# EAGLE design Kobold (EAGLE 5.11)
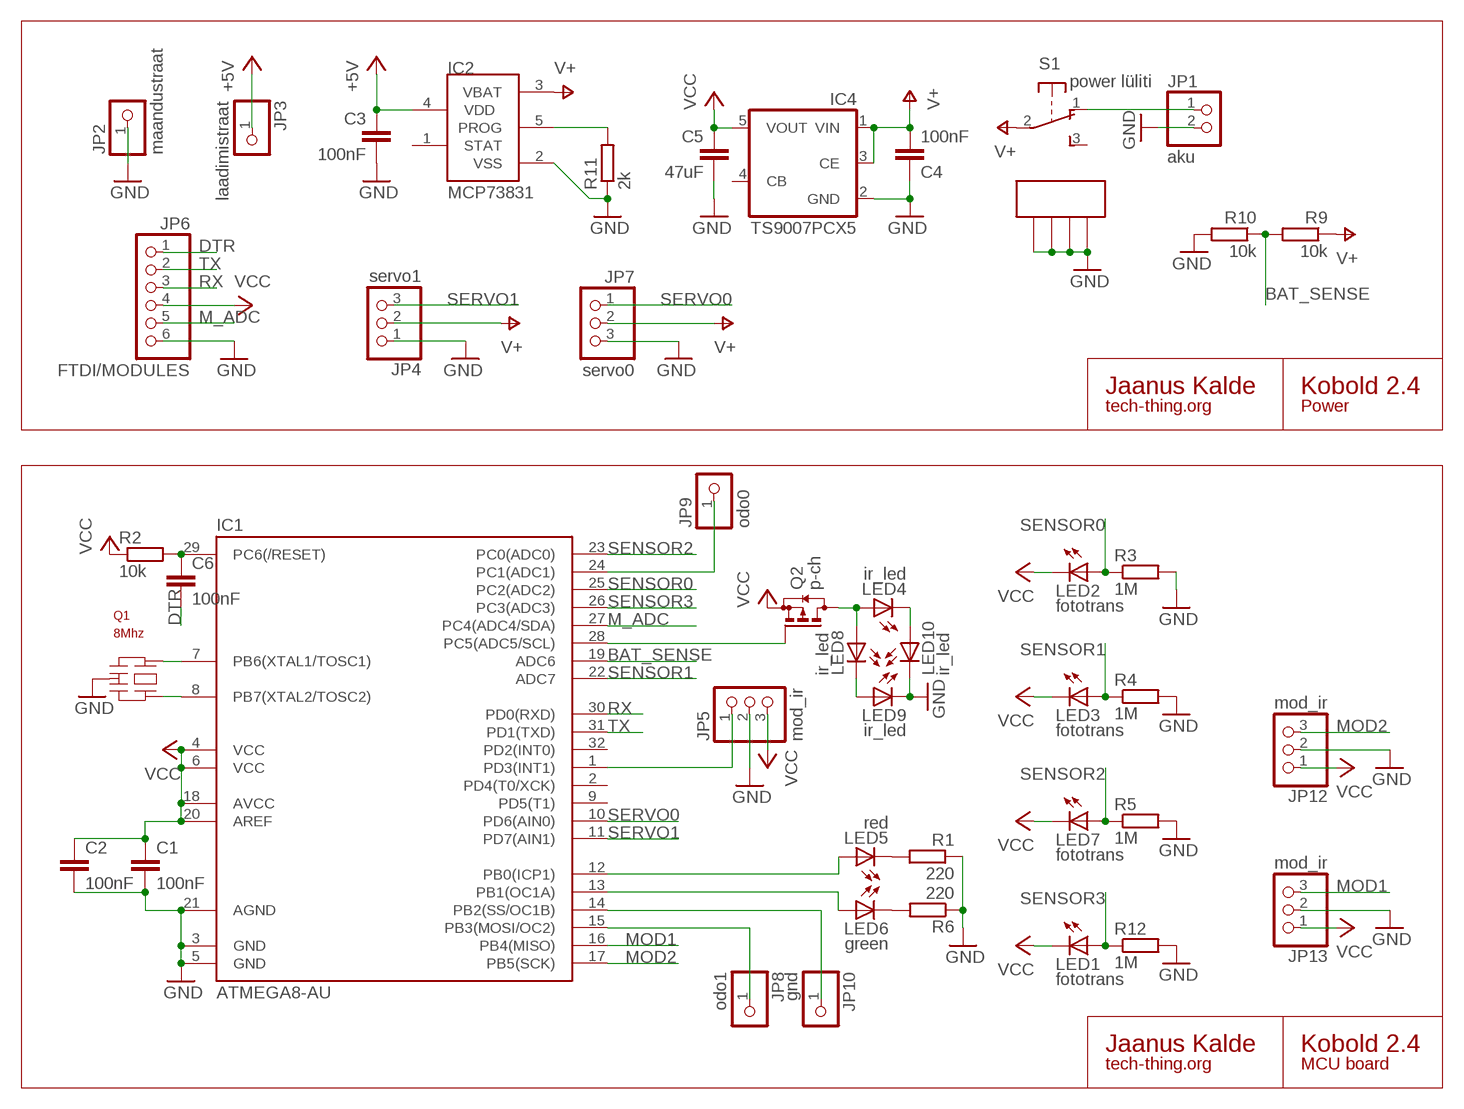
[diagram p0: schematic, sheet 1]

## Parts
C1  100nF  C-EUC0603  [C0603]
C2  100nF  C-EUC0603  [C0603]
C3  100nF  C-EUC0603  [C0603]
C4  100nF  C-EUC0603  [C0603]
C5  47uF  C-EUC3225  [C3225]
C6  100nF  C-EUC0603  [C0603]
IC1  ATMEGA8-AU  [TQFP32-08]
IC2  MCP73831  [SOT23-5L]
IC4  TS9007PCX5  TS5205  [SOT25]
JP1  aku  PINHD-1X02_2.54-S  [1X02-S]
JP2  maandustraat  PINHD-1X01_2.54-SMD-90°  [1X01SMD/90]
JP3  laadimistraat  PINHD-1X01_2.54  [1X01]
JP4  servo1  PINHD-1X03_2.54-S  [1X03-S]
JP5  mod_ir  PINHD-1X03_2.54-S  [1X03-S]
JP6  FTDI/MODULES  PINHD-1X06_2.54-S  [1X06-S]
JP7  servo0  PINHD-1X03_2.54-S  [1X03-S]
JP8  odo1  PINHD-1X01_2.54-SMD-90°  [1X01SMD/90]
JP9  odo0  PINHD-1X01_2.54-SMD-90°  [1X01SMD/90]
JP10  gnd  PINHD-1X01_2.54-SMD-90°  [1X01SMD/90]
JP12  mod_ir  PINHD-1X03_2.00  [1X03M]
JP13  mod_ir  PINHD-1X03_2.00  [1X03M]
LED1  fototrans  LED3MM  [LED3MM]
LED2  fototrans  LED3MM  [LED3MM]
LED3  fototrans  LED3MM  [LED3MM]
LED4  ir_led  LED3MM  [LED3MM]
LED5  red  LEDCHIP-LED0603  [CHIP-LED0603]
LED6  green  LEDCHIP-LED0603  [CHIP-LED0603]
LED7  fototrans  LED3MM  [LED3MM]
LED8  ir_led  LED3MM  [LED3MM]
LED9  ir_led  LED3MM  [LED3MM]
LED10  ir_led  LED3MM  [LED3MM]
Q1  8Mhz  CSTLS_G  [RES]
Q2  p-ch  BSS84  [SOT23]
R1  220  R-EU_R0603  [R0603]
R2  10k  R-EU_R0603  [R0603]
R3  1M  R-EU_R0603  [R0603]
R4  1M  R-EU_R0603  [R0603]
R5  1M  R-EU_R0603  [R0603]
R6  220  R-EU_R0603  [R0603]
R9  10k  R-EU_R0603  [R0603]
R10  10k  R-EU_R0603  [R0603]
R11  2k  R-EU_R0603  [R0603]
R12  1M  R-EU_R0603  [R0603]
S1  power lüliti  9077-1  [9077-1]

## Nets
+5V: C3.1 IC2.4(VDD) JP3.1
BAT_SENSE: IC1.19(ADC6) R9.2 R10.1
DTR: C6.2 JP6.1
GND: C1.2 C2.2 C3.2 C4.1 C5.2 IC1.3(GND) IC1.5(GND) IC1.21(AGND) IC2.2(VSS) IC4.2(GND) JP1.2 JP2.1 JP4.1 JP5.2 JP6.6 JP7.3 JP12.2 JP13.2 LED9.K(C) LED10.K(C) Q1.P$2(VSS) R1.1 R3.2 R4.2 R5.2 R6.1 R10.2 R11.1 R12.2 S1.P$1 S1.P$2 S1.P$3 S1.P$4
IR_LED: IC1.28(PC5(ADC5/SCL)) Q2.1(G)
M_ADC: IC1.27(PC4(ADC4/SDA)) JP6.5
MOD1: IC1.16(PB4(MISO)) JP13.3
MOD2: IC1.17(PB5(SCK)) JP12.3
N$1: LED6.C R6.2
N$2: IC1.13(PB1(OC1A)) LED6.A
N$3: JP1.1 S1.1(O)
N$4: IC1.15(PB3(MOSI/OC2)) JP8.1
N$5: LED8.K(C) LED9.A
N$6: LED4.K(C) LED10.A
N$7: IC1.1(PD3(INT1)) JP5.1
N$8: LED4.A LED8.A Q2.3(D)
N$9: IC1.24(PC1(ADC1)) JP9.1
N$10: IC1.7(PB6(XTAL1/TOSC1)) Q1.P$1
N$11: IC1.12(PB0(ICP1)) LED5.A
N$12: IC1.14(PB2(SS/OC1B)) JP10.1
N$15: LED5.C R1.2
N$20: IC1.8(PB7(XTAL2/TOSC2)) Q1.P$3
N$28: IC2.5(PROG) R11.2
RESET: C6.1 IC1.29(PC6(/RESET)) R2.2
RX: IC1.30(PD0(RXD)) JP6.3
SENSOR0: IC1.25(PC2(ADC2)) LED2.A R3.1
SENSOR1: IC1.22(ADC7) LED3.A R4.1
SENSOR2: IC1.23(PC0(ADC0)) LED7.A R5.1
SENSOR3: IC1.26(PC3(ADC3)) LED1.A R12.1
SERVO0: IC1.10(PD6(AIN0)) JP7.1
SERVO1: IC1.11(PD7(AIN1)) JP4.3
TX: IC1.31(PD1(TXD)) JP6.2
V+: C4.2 IC2.3(VBAT) IC4.1(VIN) IC4.3(CE) JP4.2 JP7.2 R9.1 S1.2(P)
VCC: C1.1 C2.1 C5.1 IC1.4(VCC) IC1.6(VCC) IC1.18(AVCC) IC1.20(AREF) IC4.5(VOUT) JP5.3 JP6.4 JP12.1 JP13.1 LED1.K(C) LED2.K(C) LED3.K(C) LED7.K(C) Q2.2(S) R2.1
Unconnected: IC1.2(PD4(T0/XCK)) IC1.9(PD5(T1)) IC1.32(PD2(INT0)) IC2.1(STAT) IC4.4(CB) S1.3(S)

## Notes on the sheet
- Jaanus Kalde | Kobold 2.4
- tech-thing.org | Power
- Jaanus Kalde | Kobold 2.4
- tech-thing.org | MCU board

## Library data of the parts
C1-C6 = rcl:C-EU: CAPACITOR, European symbol
IC1 = atmega8:ATMEGA8
IC2 = microchip-update:MCP73831: Miniature Single-Cell, Fully Integrated Li-Ion, Li-Polymer Charge Management Controllers
IC4 = v-reg:TS5205: 150mA Low Noise LDO Voltage Regulator with Enable TSC [Taiwan Semiconductor Company, Ltd] Source: http://www.taiwansemi.com .. 5205_0409c.pdf
JP1 = pinhead-2:PINHD-1X02: PIN HEADER
JP2 JP3 JP8-JP10 = pinhead-2:PINHD-1X01: PIN HEADER
JP4 JP5 JP7 JP12 JP13 = pinhead-2:PINHD-1X03: PIN HEADER
JP6 = pinhead-2:PINHD-1X06: PIN HEADER
LED1-LED10 = led:LED: LED OSRAM: - CHIPLED LG R971, LG N971, LY N971, LG Q971, LY Q971, LO R971, LY R971 LH N974, LH R974 LS Q976, LO Q976, LY Q976 LO Q996 - Hyper CHIPLED LW Q18S LB Q993, LB Q99A, LB R99A - SideLED LS A670, LO A670, LY A670, LG A670, LP A670 LB A673, LV A673, LT A673, LW A673 LH A674 LY A675 LS A676, LA A676, LO A676, LY A676, LW A676 LS A679, LY A679, LG A679 - Hyper Micro SIDELED® LS Y876, LA Y876, LO Y876, LY Y876 LT Y87S - SmartLED LW L88C, LW L88S LB L89C, LB L89S, LG L890 LS L89K, LO L89K, LY L89K LS L896, LA L896, LO L896, LY L896 - TOPLED LS T670, LO T670, LY T670, LG T670, LP T670 LSG T670, LSP T670, LSY T670, LOP T670, LYG T670 LG T671, LOG T671, LSG T671 LB T673, LV T673, LT T673, LW T673 LH T674 LS T676, LA T676, LO T676, LY T676, LB T676, LH T676, LSB T676, LW T676 LB T67C, LV T67C, LT T67C, LS T67K, LO T67K, LY T67K, LW E67C LS E67B, LA E67B, LO E67B, LY E67B, LB E67C, LV E67C, LT E67C LW T67C LS T679, LY T679, LG T679 LS T770, LO T770, LY T770, LG T770, LP T770 LB T773, LV T773, LT T773, LW T773 LH T774 LS E675, LA E675, LY E675, LS T675 LS T776, LA T776, LO T776, LY T776, LB T776 LHGB T686 LT T68C, LB T68C - Hyper Mini TOPLED® LB M676 - Mini TOPLED Santana® LG M470 LS M47K, LO M47K, LY M47K Source: http://www.osram.convergy.de LUXEON: - LUMILED® LXK2-PW12-R00, LXK2-PW12-S00, LXK2-PW14-U00, LXK2-PW14-V00 LXK2-PM12-R00, LXK2-PM12-S00, LXK2-PM14-U00 LXK2-PE12-Q00, LXK2-PE12-R00, LXK2-PE12-S00, LXK2-PE14-T00, LXK2-PE14-U00 LXK2-PB12-K00, LXK2-PB12-L00, LXK2-PB12-M00, LXK2-PB14-N00, LXK2-PB14-P00, LXK2-PB14-Q00 LXK2-PR12-L00, LXK2-PR12-M00, LXK2-PR14-Q00, LXK2-PR14-R00 LXK2-PD12-Q00, LXK2-PD12-R00, LXK2-PD12-S00 LXK2-PH12-R00, LXK2-PH12-S00 LXK2-PL12-P00, LXK2-PL12-Q00, LXK2-PL12-R00 Source: www.luxeon.com KINGBRIGHT: KA-3528ASYC Source: www.kingbright.com
Q1 = oma:CSTLS_G: Ceramic resonator 2.00 to 10.00 MHz
Q2 = transistor-small-signal:BSS84: P-CHANNEL MOS FET
R1-R6 R9-R12 = rcl:R-EU_: RESISTOR, European symbol
S1 = oma:9077-1: MARQUARDT SWITCH

## Board
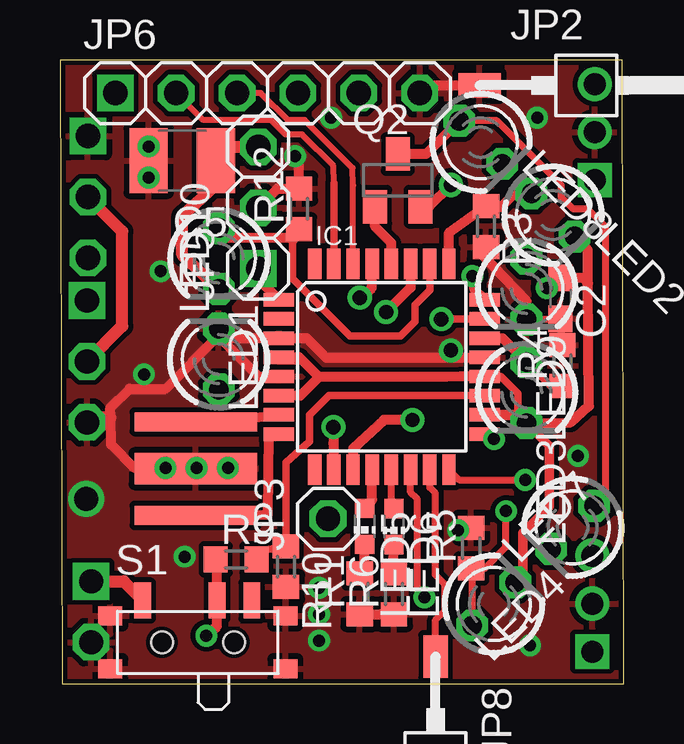
[diagram p1: board, top side]
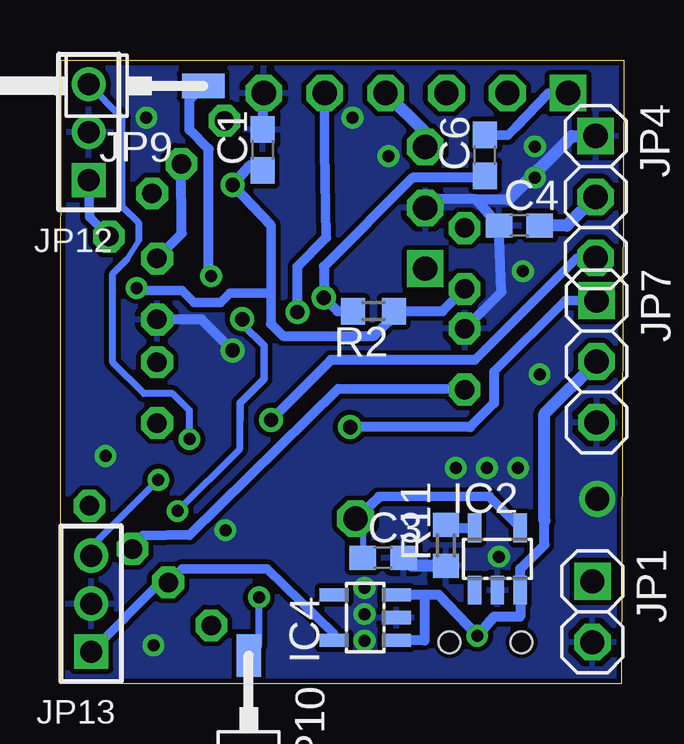
[diagram p2: board, bottom side, seen from below]

Size 23.5 x 26.01 mm. Coordinates in mm from the lower left corner, seen from the top.
Outline: 0.1,0 23.5,0 23.44,26.01 18.3,26 0,26.01 0.1,0
Copper layers (1+16): Top 0.035mm / dielectric 1.5mm / Bottom 0.035mm
Design rules "8mils *": minimum track width 8mil, minimum drill 0.4mm, track to track 8mil, track to pad 8mil, pad to pad 8mil, via to via 8mil, smd to smd 0mil, copper to edge 8mil, drill to drill 8mil, minimum pad ring 10mil, minimum via ring 8mil, stop-mask expansion 0mil, vias tented up to drill 0mil, thermal gap 10mil

### Footprints (pad centres in the part's own frame; a part is rotated, then mirrored left to right if it is on the bottom)
C0603 = smd 1.1 x 1: 1 -0.85,0; 2 0.85,0
C3225 = smd 1.6 x 2.7: 1 -1.4,0; 2 1.4,0
TQFP32-08 = smd 1.27 x 0.559: 1 -4.293,2.8; 2 -4.293,2; 3 -4.293,1.2; 4 -4.293,0.4; 5 -4.293,-0.4; 6 -4.293,-1.2; 7 -4.293,-2; 8 -4.293,-2.8; 17 4.293,-2.8; 18 4.293,-2; 19 4.293,-1.2; 20 4.293,-0.4; 21 4.293,0.4; 22 4.293,1.2; 23 4.293,2; 24 4.293,2.8 | smd 0.559 x 1.27: 9 -2.8,-4.293; 10 -2,-4.293; 11 -1.2,-4.293; 12 -0.4,-4.293; 13 0.4,-4.293; 14 1.2,-4.293; 15 2,-4.293; 16 2.8,-4.293; 25 2.8,4.293; 26 2,4.293; 27 1.2,4.293; 28 0.4,4.293; 29 -0.4,4.293; 30 -1.2,4.293; 31 -2,4.293; 32 -2.8,4.293
SOT23-5L = smd 0.55 x 1.2: 1 -0.95,-1.3; 2 0,-1.3; 3 0.95,-1.3; 4 0.95,1.3; 5 -0.95,1.3
SOT25 = smd 0.55 x 1.2: 1 -0.95,-1.3; 2 0,-1.3; 3 0.95,-1.3; 4 0.95,1.3; 5 -0.95,1.3
1X02-S = drill 1.016 square: 1 -1.27,0 | drill 1.016 octagon: 2 1.27,0
1X01SMD/90 = smd 1.016 x 1.778: 1 -1.27,-5.08
1X01 = drill 1.016 octagon: 1 0,0
1X03-S = drill 1.016 square: 1 -2.54,0 | drill 1.016 octagon: 2 0,0; 3 2.54,0
1X06-S = drill 1.016 square: 1 -6.35,0 | drill 1.016 octagon: 2 -3.81,0; 3 -1.27,0; 4 1.27,0; 5 3.81,0; 6 6.35,0
1X03M = drill 0.914 square: 1 -2,0 | drill 0.914 round: 2 0,0; 3 2,0
LED3MM = drill 0.813 octagon: A -1.27,0; K 1.27,0
CHIP-LED0603 = smd 0.8 x 0.8: A 0,-0.75; C 0,0.75
RES = smd 0.8 x 5.1: P$1 -1.95,0; P$3 1.95,0 | smd 1.3 x 5.1: P$2 0,0
SOT23 = smd 1 x 1.4: 1 -0.95,-1.1; 2 0.95,-1.1; 3 0,1.1
R0603 = smd 1 x 1.1: 1 -0.85,0; 2 0.85,0
9077-1 = smd 0.7 x 1.5: 1 -2.3,1.75; 2 0.8,1.75; 3 2.25,1.75 | smd 1 x 0.8: P$1 3.65,1.1; P$2 3.65,-1.1; P$3 -3.65,-1.1; P$4 -3.65,1.1 | hole 0.9: 1.5,0; -1.5,0

### Placement (x,y rotation side)
C1  15.04,22.26 90 bottom
C2  20.87,16.07 270 top
C3  10.03,5.25 0 bottom
C4  4.34,19.1 0 bottom
C5  5.1,21.81 180 top
C6  5.78,22.03 90 bottom
IC1  13.42,13.21 0 top
IC2  5.26,5.2 0 bottom
IC4  10.77,2.76 90 bottom
JP1  1.3,3 270 bottom
JP2  22.57,23.68 270 top
JP3  11.18,6.88 90 top
JP4  1.16,20.3 270 bottom
JP5  8.27,19.85 90 top
JP6  8.66,24.63 0 top
JP7  1.12,13.44 270 bottom
JP8  14.39,-3.94 180 top
JP9  22.6,26.2 90 bottom
JP10  16.9,-3.9 180 bottom
JP12  22.3,23 90 bottom
JP13  22.2,3.34 90 bottom
LED1  6.62,17.73 270 top
LED2  20.56,19.54 315 top
LED3  19.45,12.14 270 top
LED4  21.38,6.52 225 top
LED5  12.71,6.57 180 top
LED6  13.93,6.55 180 top
LED7  18.09,3.33 45 top
LED8  17.54,22.58 315 top
LED9  19.45,16.46 270 top
LED10  6.62,13.54 90 top
Q1  5.66,8.97 270 top
Q2  14.09,20.99 0 top
R1  12.5,3.75 90 top
R2  10.43,15.53 180 bottom
R3  17.77,19.07 270 top
R4  20.95,13.27 90 top
R5  17.15,5.66 90 top
R6  13.93,3.75 90 top
R9  7.34,5.19 0 top
R10  9.42,4.88 270 top
R11  7.41,5.77 90 bottom
R12  9.97,19.8 90 top
S1  5.75,1.73 0 top

### Tracks (layer width: path | path; a pad name or v marks a point on that pad's centre or on a via)
+5V
  Bottom 0.254: C3.1 10.88,6.58 JP3.1
  Bottom 0.406: JP3.1 10.2,7.8 5.61,7.81 IC2.4
BAT_SENSE
  Top 0.305: R9.2 8.34,5.54 R10.1 9.42,9.22 10.4,10.1 10.4,11.2 11.21,12.01 IC1.19
DTR
  Bottom 0.4: C6.2 4.82,22.88 4.5,23.2 3.14,24.63 JP6.1
GND  (via drill 0.5, 0.6, 1)
  Top 0.3: 20.85,15.2 R4.2 | 20.85,15.2 C2.2 | 20.85,15.2 LED9.K
  Top 0.406: 16.2,13.61 11.1,13.6 10.29,14.41 IC1.3 7.02,14.41 LED10.K | 16.2,13.61 IC1.21 | IC1.5 8.29,12.81 6.62,14.48 LED10.K | R3.2 17.58,17.92 19.45,15.95 LED9.K 19.45,15.22 | JP5.2 9.07,20.65 R12.2 9.97,21.77 v9.8,22 | C5.2 3.2,21.81 | LED10.K 6.62,14.52 4.4,12.3 2.9,12.3 2.1,11.5 2.11,11.1 2.13,9.97 3.1,9 Q1.P$2 | v16.3,13.9 16.2,13.61 | R6.1 13.37,2.9 R1.1 | JP2.1 15.33,24.95 JP6.6
  Top 0.5: JP7.3 1.33,11.1 2.11,11.1
  Bottom 0.254: R11.1 7.74,5.25
  Bottom 0.406: 6.16,20.2 C4.1 5.09,16.34 LED10.K | 6.16,20.2 7.92,20.2 JP5.2 | JP6.6 15.04,24.59 C1.2 | 6.16,20.2 4.8,20.2 | LED9.K 17.59,15.19 v16.3,13.9
  Bottom 0.5: C3.2 8.84,4.92 R11.1 | 4.8,20.2 2.16,22.84 JP4.1
  other vias: 11.3,23.6 16.6,6.4 19.9,23.6 1.1,7.7 19.6,1.6 21.6,9.5 3.5,12.9 4.2,17.2 7,9 5.7,9 4.4,9 10.8,2.9 10.8,4 10.8,1.8 5.2,5.3 3.7,22.4 3.7,21.1
  pour Bottom: 0,26.1 0,-0.1 23.9,-0.2 23.7,26.3
  pour Top: -0.1,26.1 -0.1,-0.1 24.4,-0.1 24.4,26.1
IR_LED
  Top 0.406: IC1.28 13.82,18.38 13.14,19.06 Q2.1
M_ADC  (via drill 0.6)
  Top 0.406: IC1.27 14.62,16.52 v13.6,15.5
  Bottom 0.4: 12.4,18.6 12.46,22.3 JP6.5
  Bottom 0.406: v13.6,15.5 13.6,17.39 12.4,18.6
MOD1  (via drill 0.5)
  Top 0.3: v19.4,8.5 16.64,8.5 IC1.16
  Bottom 0.3: JP13.3 22.19,5.71 v19.4,8.5
MOD2  (via drill 0.5)
  Top 0.3: IC1.17 18.01,10.41 v18.1,10.2
  Bottom 0.22: 20.7,17.7 20.2,18.5
  Bottom 0.3: JP12.3 20.9,23.59 20.9,19.9 20.2,19.2 20.2,18.5 | 20.7,17.7 21.3,17.1 21.3,13.4 20,12.1 18.8,12.1 18.1,11.4 v18.1,10.2
N$1
  Top 0.406: LED6.C 13.9,4.92 R6.2
N$2
  Top 0.3: LED6.A 13.82,7.51 IC1.13
N$3
  Top 0.5: JP1.1 2.66,4.27 S1.1
N$4
  Top 0.3: IC1.15 15.42,8.18 15.65,7.95 15.65,4.55 16.05,4.15 16.05,3.05 15.66,2.66 JP8.1
N$5
  Bottom 0.406: LED8.K 18.42,18.78 19.45,17.75 LED9.A
N$6
  Bottom 0.406: LED4.K 20.03,6.17 18.1,6.2 11.9,12.3 LED10.A
N$7
  Top 0.406: IC1.1 8.27,16.87 JP5.1
N$8
  Top 0.3: LED8.A 18.23,23.48 20.9,20.8 20.9,20.3 21.4,19.8 22,19.8 22.75,19.05 22.75,7.89
  Top 0.406: Q2.3 15.26,22.09 LED8.A | LED4.A 22.75,7.89
N$9  (via drill 0.5)
  Top 0.406: v17.2,17 17.3,16.42 IC1.24
  Bottom 0.406: JP9.1 18.1,24.35 18.1,23.1 17.3,22.3 17.3,17.2 v17.2,17
N$10
  Top 0.406: Q1.P$1 8.84,11.17 IC1.7
N$11
  Top 0.406: LED5.A 13.02,7.67 IC1.12
N$12  (via drill 0.5)
  Top 0.3: IC1.14 14.62,7.98 14.9,7.7 14.9,3.9 v15.2,3.6
  Bottom 0.3: v15.2,3.6 15.2,1.61 JP10.1
N$15
  Top 0.406: LED5.C 12.7,4.81 R1.2
N$20
  Top 0.406: IC1.8 8.72,10.41 8.68,7.07 Q1.P$3
N$28
  Bottom 0.406: IC2.5 7.41,6.5 R11.2
RESET  (via drill 0.6)
  Top 0.406: v12.5,16.1 13,16.5 13,17.49 IC1.29
  Bottom 0.406: C6.1 6.17,21.1 8.8,21.1 12.5,17.4 v12.5,16.1 11.93,15.53 R2.2
RX
  Top 0.254: JP6.3 8.37,24.63 9.5,23.5 10.2,23.5 12.2,21.5 12.22,20.78 IC1.30
SENSOR0
  Top 0.406: IC1.25 16.22,18.8 R3.1 18.38,19.88 18.94,20.44 LED2.A
SENSOR1
  Top 0.3: R4.1 20.44,12.42 LED3.A
  Top 0.406: LED3.A 18.45,14.41 IC1.22
SENSOR2  (via drill 0.5, 0.6)
  Top 0.3: v18.6,7.2 18.6,5.7 17.69,4.79 17.19,4.76 | 17.19,4.76 R5.1 | LED7.A 17.19,4.76
  Top 0.305: v15.9,15.2 16.49,15.21 IC1.23
  Bottom 0.3: 16,11 16,9.8 v18.6,7.2
  Bottom 0.305: 16,11 16,11.7 15,12.7 15,14.1 15.9,15 v15.9,15.2
SENSOR3
  Top 0.305: R12.1 9.7,18.48 9.7,16.9 12.1,14.5 14.2,14.5 14.8,15.1 14.8,15.8 15.42,16.42 IC1.26
  Top 0.406: LED1.A 7.02,18.6 9.7,18.6 9.7,18.48
SERVO0  (via drill 0.6)
  Top 0.406: IC1.10 11.4,10.04 v11.4,10.7
  Bottom 0.4: 5.4,13.01 2.44,15.98 JP7.1
  Bottom 0.406: v11.4,10.7 6.4,10.7 5.4,11.7 5.4,13.01
SERVO1  (via drill 0.6)
  Top 0.406: v14.7,11 13.5,11 12.22,9.82 IC1.11
  Bottom 0.4: 6.2,13.5 1.94,17.76 JP4.3
  Bottom 0.406: 6.2,13.5 12.2,13.5 v14.7,11
TX
  Top 0.254: JP6.2 5.97,23.5 8.8,23.5 9.4,22.9 10.1,22.9 11.4,21.6 11.42,20.88
  Top 0.305: IC1.31 11.42,20.88
V+  (via drill 0.5)
  Top 0.406: R9.1 6.55,5.19 S1.2 6.55,2.4 v6.1,2
  Top 0.5: JP7.2 2.6,14.91 2.6,18.86 JP4.2
  Bottom 0.406: 8.3,3.71 7.71,3.71 v6.1,2 5.4,2.8 4.31,2.8 IC2.3 4.31,4.8 3.3,5.8 3.3,6.8 3.3,6.9 | 8.3,3.71 IC4.3 | IC4.1 8.3,1.81 8.3,3.71
  Bottom 0.5: JP7.2 3.3,11.26 3.3,6.8 | C4.2 2.36,19.1 JP4.2
VCC  (via drill 0.5, 0.6)
  Top 0.254: C5.1 7.08,22.39
  Top 0.305: 19.1,11.21 19.1,12.1 18.39,12.81 IC1.20
  Top 0.4: v20.3,16.5 20.72,16.92 C2.1 | LED3.K 20.4,9.92 20.4,7.4 19.3,6.3 19.3,4.54 LED7.K
  Top 0.406: IC1.20 16.71,12.81 16.1,12.8 10.8,12.8 | IC1.6 10.01,12 10.8,12.8 | 9.99,13.61 IC1.4 | 10.8,12.8 9.99,13.61 | v16.3,20.8 15.39,19.89 Q2.2 | 22.02,16.7 22.05,11.57 21.3,10.9 LED3.K 19.11,11.21 IC1.18 19.1,11.21 | 22.02,16.7 22,18.1 LED2.K | 6.5,20.8 C5.1 | 9.99,13.61 9.88,13.5 9.1,13.5 | C2.1 21.82,16.92 22.02,16.7
  Top 0.5: 7.08,22.39 JP5.3 | LED1.K 5.1,17.88 5.1,19.5 6.5,20.8
  Bottom 0.305: IC4.5 12.1,1.84
  Bottom 0.4: 12.1,1.84 12.1,2.1 14.86,4.8 18.41,4.8 LED7.K 19.31,4.23 JP13.1 | JP12.1 22.25,19.46 LED2.K | 14.7,16.3 14.7,15 | 14.7,16.3 16.4,16.3 16.8,15.9 17.9,15.9 18.4,16.4 20.2,16.4 v20.3,16.5 | 14.7,16.3 14.7,19.1
  Bottom 0.406: LED1.K 7.55,15.53 R2.1 9.78,15.12 10.4,14.5 14.2,14.5 14.7,15 | C1.1 15.59,21.61 v16.3,20.8 14.7,19.1
  Bottom 0.5: JP6.4 8.27,22.97 JP5.3

### Text on the board
tTest: RST | VCC | MOD | GND | 0 | sens. | sens. | 1 | 3 | sens. | +5V | 2 | sens. | ON | Kobold
bTest: GND | V+ | S1 | S0 | V+ | Kobold 1.4 | GND | 2011 | jaanus.tech-thing.org | V+